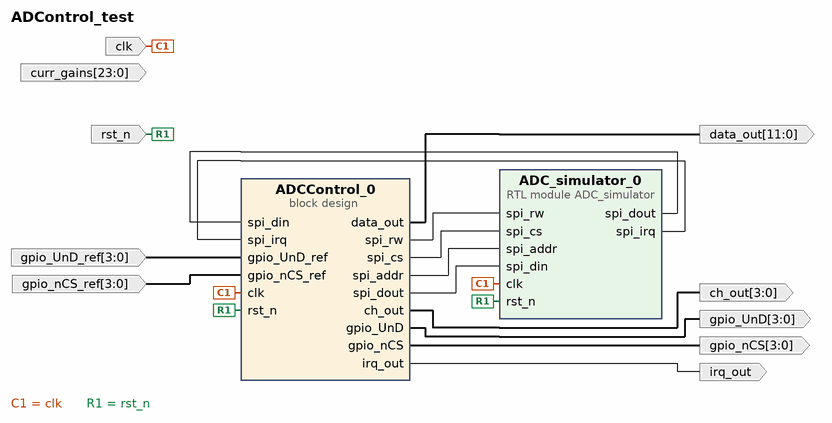
[diagram p0: block diagram of the top level]
# Vivado block design ADControl_test, xczu3eg-sbva484-1-i, Vivado 2020.2
create_bd_design ADControl_test

create_bd_port -dir I -type clk clk
create_bd_port -dir I -type rst rst_n
create_bd_port -dir I -from 3 -to 0 gpio_UnD_ref
create_bd_port -dir I -from 3 -to 0 gpio_nCS_ref
create_bd_port -dir I -from 23 -to 0 curr_gains
create_bd_port -dir O -from 11 -to 0 data_out
create_bd_port -dir O -from 3 -to 0 gpio_UnD
create_bd_port -dir O irq_out
create_bd_port -dir O -from 3 -to 0 ch_out
create_bd_port -dir O -from 3 -to 0 gpio_nCS

create_bd_cell -type container -reference ADCControl ADCControl_0
set_property -dict [list \
  CONFIG.ACTIVE_SIM_BD ADCControl.bd \
  CONFIG.ACTIVE_SYNTH_BD ADCControl.bd \
  CONFIG.ENABLE_DFX 0 \
  CONFIG.LIST_SIM_BD ADCControl.bd \
  CONFIG.LIST_SYNTH_BD ADCControl.bd \
  CONFIG.LOCK_PROPAGATE 0 \
  CONFIG.TRAINING_MODULE ADCControl.bd \
] [get_bd_cells ADCControl_0]
create_bd_cell -type module -reference ADC_simulator ADC_simulator_0

# ---- connections ----

connect_bd_net -net clk_0_1 [get_bd_ports clk] [get_bd_pins ADC_simulator_0/clk] [get_bd_pins ADCControl_0/clk]
connect_bd_net -net rst_n_0_1 [get_bd_ports rst_n] [get_bd_pins ADC_simulator_0/rst_n] [get_bd_pins ADCControl_0/rst_n]
connect_bd_net [get_bd_pins ADCControl_0/spi_rw] [get_bd_pins ADC_simulator_0/spi_rw]
connect_bd_net [get_bd_pins ADCControl_0/spi_cs] [get_bd_pins ADC_simulator_0/spi_cs]
connect_bd_net [get_bd_pins ADCControl_0/spi_addr] [get_bd_pins ADC_simulator_0/spi_addr]
connect_bd_net [get_bd_pins ADCControl_0/spi_dout] [get_bd_pins ADC_simulator_0/spi_din]
connect_bd_net [get_bd_pins ADC_simulator_0/spi_dout] [get_bd_pins ADCControl_0/spi_din]
connect_bd_net -net spi_irq_1 [get_bd_pins ADC_simulator_0/spi_irq] [get_bd_pins ADCControl_0/spi_irq]
connect_bd_net -net gpio_UnD_ref_0_1 [get_bd_ports gpio_UnD_ref] [get_bd_pins ADCControl_0/gpio_UnD_ref]
connect_bd_net -net gpio_nCS_ref_0_1 [get_bd_ports gpio_nCS_ref] [get_bd_pins ADCControl_0/gpio_nCS_ref]
# net curr_gains_0_1 has one end: curr_gains
connect_bd_net [get_bd_pins ADCControl_0/data_out] [get_bd_ports data_out]
connect_bd_net [get_bd_pins ADCControl_0/gpio_UnD] [get_bd_ports gpio_UnD]
connect_bd_net [get_bd_pins ADCControl_0/irq_out] [get_bd_ports irq_out]
connect_bd_net [get_bd_pins ADCControl_0/ch_out] [get_bd_ports ch_out]
connect_bd_net [get_bd_pins ADCControl_0/gpio_nCS] [get_bd_ports gpio_nCS]

validate_bd_design
save_bd_design
